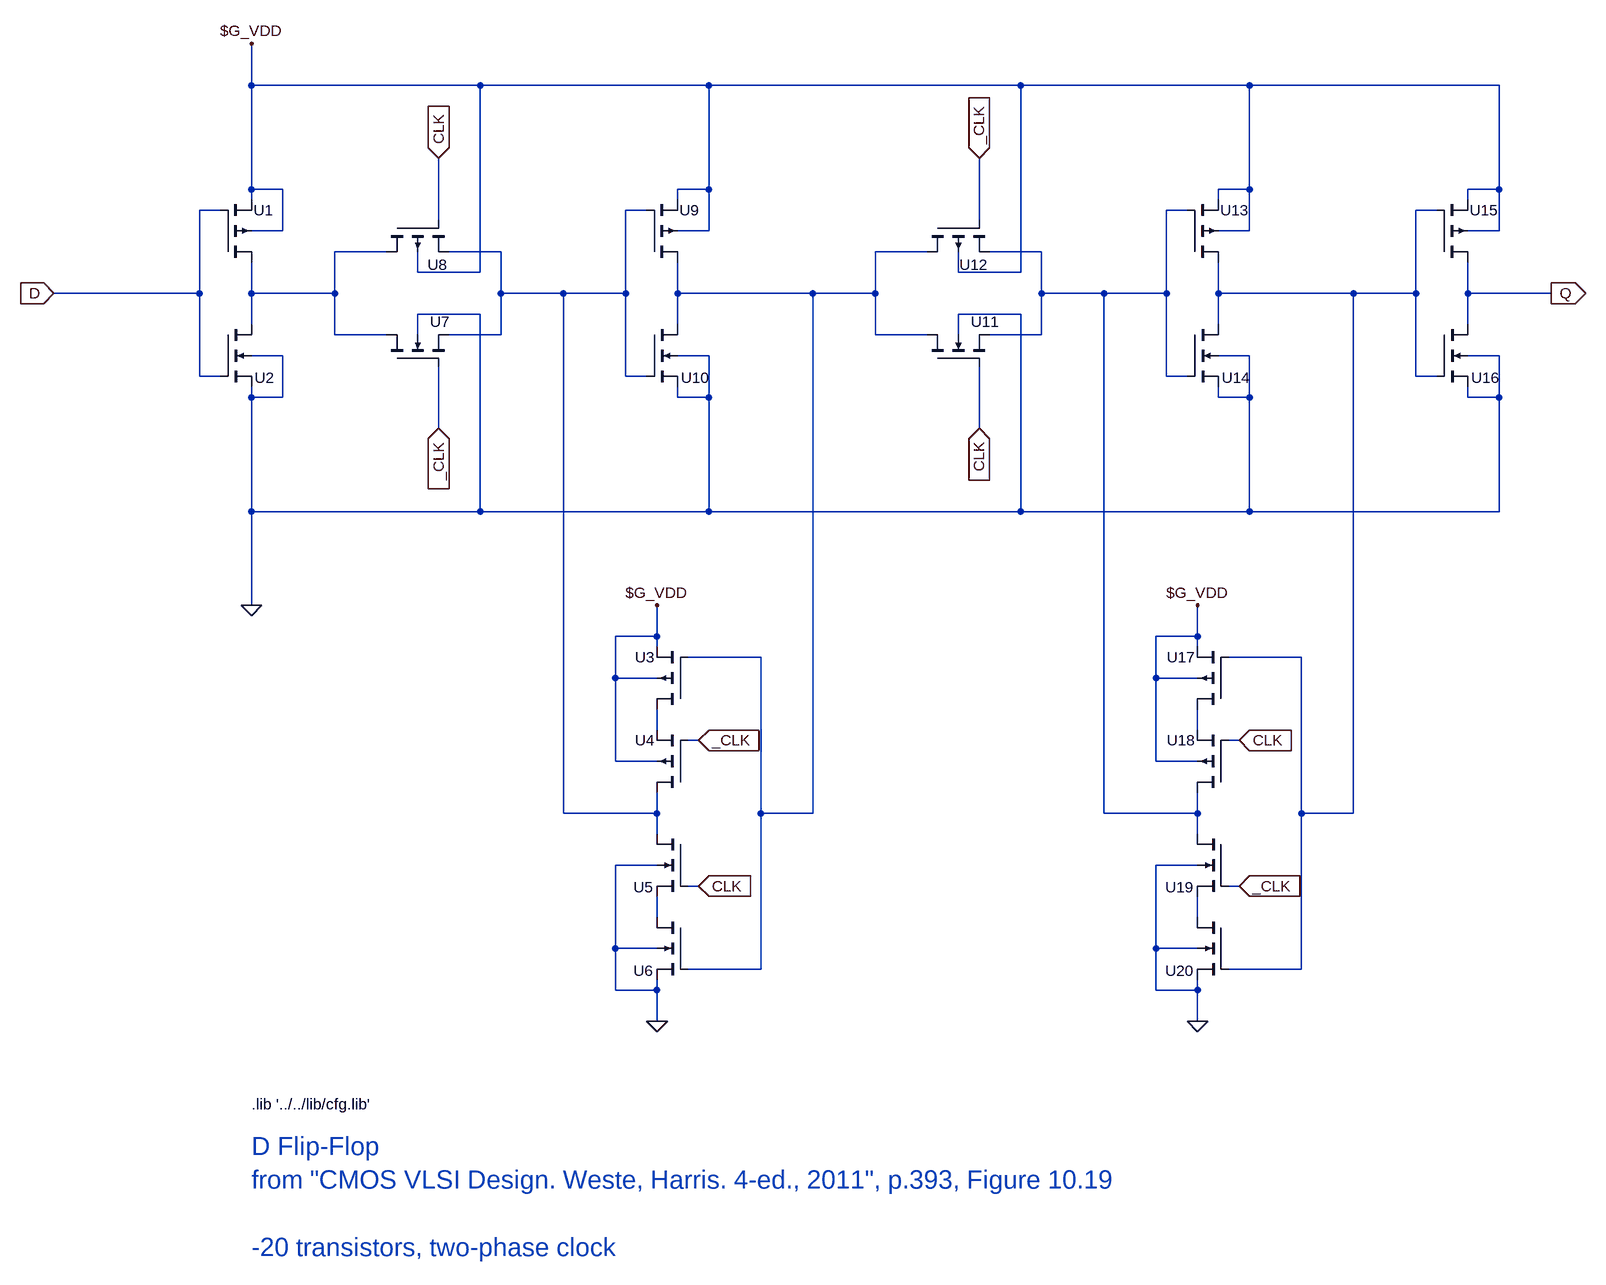
[diagram p0: schematic ff1.asc]
ff1.asc, the LTspice schematic file:
Version 4
SHEET 1 2652 3572
WIRE -5760 1088 -5760 1024
WIRE -5408 1088 -5760 1088
WIRE -5056 1088 -5408 1088
WIRE -4576 1088 -5056 1088
WIRE -4224 1088 -4576 1088
WIRE -3840 1088 -4224 1088
WIRE -5760 1248 -5760 1088
WIRE -5712 1248 -5760 1248
WIRE -5056 1248 -5056 1088
WIRE -5056 1248 -5104 1248
WIRE -4224 1248 -4224 1088
WIRE -4224 1248 -4272 1248
WIRE -3840 1248 -3840 1088
WIRE -3840 1248 -3888 1248
WIRE -5760 1264 -5760 1248
WIRE -5104 1264 -5104 1248
WIRE -4272 1264 -4272 1248
WIRE -3888 1264 -3888 1248
WIRE -5808 1280 -5840 1280
WIRE -5152 1280 -5184 1280
WIRE -4320 1280 -4352 1280
WIRE -3936 1280 -3968 1280
WIRE -5472 1296 -5472 1200
WIRE -4640 1296 -4640 1200
WIRE -5712 1312 -5712 1248
WIRE -5712 1312 -5760 1312
WIRE -5056 1312 -5056 1248
WIRE -5056 1312 -5104 1312
WIRE -4224 1312 -4224 1248
WIRE -4224 1312 -4272 1312
WIRE -3840 1312 -3840 1248
WIRE -3840 1312 -3888 1312
WIRE -5552 1344 -5632 1344
WIRE -5376 1344 -5456 1344
WIRE -4720 1344 -4800 1344
WIRE -4544 1344 -4624 1344
WIRE -5504 1376 -5504 1344
WIRE -5408 1376 -5408 1088
WIRE -5408 1376 -5504 1376
WIRE -4672 1376 -4672 1344
WIRE -4576 1376 -4576 1088
WIRE -4576 1376 -4672 1376
WIRE -5840 1408 -5840 1280
WIRE -5840 1408 -6064 1408
WIRE -5760 1408 -5760 1360
WIRE -5632 1408 -5632 1344
WIRE -5632 1408 -5760 1408
WIRE -5376 1408 -5376 1344
WIRE -5280 1408 -5376 1408
WIRE -5184 1408 -5184 1280
WIRE -5184 1408 -5280 1408
WIRE -5104 1408 -5104 1360
WIRE -4896 1408 -5104 1408
WIRE -4800 1408 -4800 1344
WIRE -4800 1408 -4896 1408
WIRE -4544 1408 -4544 1344
WIRE -4448 1408 -4544 1408
WIRE -4352 1408 -4352 1280
WIRE -4352 1408 -4448 1408
WIRE -4272 1408 -4272 1360
WIRE -4064 1408 -4272 1408
WIRE -3968 1408 -3968 1280
WIRE -3968 1408 -4064 1408
WIRE -3888 1408 -3888 1360
WIRE -3760 1408 -3888 1408
WIRE -5408 1440 -5504 1440
WIRE -4576 1440 -4672 1440
WIRE -5760 1456 -5760 1408
WIRE -5104 1456 -5104 1408
WIRE -4272 1456 -4272 1408
WIRE -3888 1456 -3888 1408
WIRE -5632 1472 -5632 1408
WIRE -5552 1472 -5632 1472
WIRE -5504 1472 -5504 1440
WIRE -5376 1472 -5376 1408
WIRE -5376 1472 -5456 1472
WIRE -4800 1472 -4800 1408
WIRE -4720 1472 -4800 1472
WIRE -4672 1472 -4672 1440
WIRE -4544 1472 -4544 1408
WIRE -4544 1472 -4624 1472
WIRE -5712 1504 -5760 1504
WIRE -5056 1504 -5104 1504
WIRE -4224 1504 -4272 1504
WIRE -3840 1504 -3888 1504
WIRE -5840 1536 -5840 1408
WIRE -5808 1536 -5840 1536
WIRE -5184 1536 -5184 1408
WIRE -5152 1536 -5184 1536
WIRE -4352 1536 -4352 1408
WIRE -4320 1536 -4352 1536
WIRE -3968 1536 -3968 1408
WIRE -3936 1536 -3968 1536
WIRE -5760 1568 -5760 1552
WIRE -5712 1568 -5712 1504
WIRE -5712 1568 -5760 1568
WIRE -5104 1568 -5104 1552
WIRE -5056 1568 -5056 1504
WIRE -5056 1568 -5104 1568
WIRE -4272 1568 -4272 1552
WIRE -4224 1568 -4224 1504
WIRE -4224 1568 -4272 1568
WIRE -3888 1568 -3888 1552
WIRE -3840 1568 -3840 1504
WIRE -3840 1568 -3888 1568
WIRE -5472 1616 -5472 1520
WIRE -4640 1616 -4640 1520
WIRE -5760 1744 -5760 1568
WIRE -5408 1744 -5408 1440
WIRE -5408 1744 -5760 1744
WIRE -5056 1744 -5056 1568
WIRE -5056 1744 -5408 1744
WIRE -4576 1744 -4576 1440
WIRE -4576 1744 -5056 1744
WIRE -4224 1744 -4224 1568
WIRE -4224 1744 -4576 1744
WIRE -3840 1744 -3840 1568
WIRE -3840 1744 -4224 1744
WIRE -5760 1888 -5760 1744
WIRE -5136 1936 -5136 1888
WIRE -5136 1936 -5200 1936
WIRE -4304 1936 -4304 1888
WIRE -4304 1936 -4368 1936
WIRE -5136 1952 -5136 1936
WIRE -4304 1952 -4304 1936
WIRE -4976 1968 -5088 1968
WIRE -4144 1968 -4256 1968
WIRE -5200 2000 -5200 1936
WIRE -5136 2000 -5200 2000
WIRE -4368 2000 -4368 1936
WIRE -4304 2000 -4368 2000
WIRE -5136 2080 -5136 2048
WIRE -4304 2080 -4304 2048
WIRE -5072 2096 -5088 2096
WIRE -4240 2096 -4256 2096
WIRE -5200 2128 -5200 2000
WIRE -5136 2128 -5200 2128
WIRE -4368 2128 -4368 2000
WIRE -4304 2128 -4368 2128
WIRE -5280 2208 -5280 1408
WIRE -5136 2208 -5136 2176
WIRE -5136 2208 -5280 2208
WIRE -4976 2208 -4976 1968
WIRE -4896 2208 -4896 1408
WIRE -4896 2208 -4976 2208
WIRE -4448 2208 -4448 1408
WIRE -4304 2208 -4304 2176
WIRE -4304 2208 -4448 2208
WIRE -4144 2208 -4144 1968
WIRE -4064 2208 -4064 1408
WIRE -4064 2208 -4144 2208
WIRE -5136 2240 -5136 2208
WIRE -4304 2240 -4304 2208
WIRE -5136 2288 -5200 2288
WIRE -4304 2288 -4368 2288
WIRE -5072 2320 -5088 2320
WIRE -4240 2320 -4256 2320
WIRE -5136 2368 -5136 2336
WIRE -4304 2368 -4304 2336
WIRE -5200 2416 -5200 2288
WIRE -5136 2416 -5200 2416
WIRE -4368 2416 -4368 2288
WIRE -4304 2416 -4368 2416
WIRE -4976 2448 -4976 2208
WIRE -4976 2448 -5088 2448
WIRE -4144 2448 -4144 2208
WIRE -4144 2448 -4256 2448
WIRE -5200 2480 -5200 2416
WIRE -5136 2480 -5136 2464
WIRE -5136 2480 -5200 2480
WIRE -4368 2480 -4368 2416
WIRE -4304 2480 -4304 2464
WIRE -4304 2480 -4368 2480
WIRE -5136 2528 -5136 2480
WIRE -4304 2528 -4304 2480
FLAG -5760 1888 0
FLAG -6064 1408 D
IOPIN -6064 1408 In
FLAG -5136 1888 $G_VDD
FLAG -5136 2528 0
FLAG -5472 1200 CLK
IOPIN -5472 1200 In
FLAG -5472 1616 _CLK
IOPIN -5472 1616 In
FLAG -4640 1200 _CLK
IOPIN -4640 1200 In
FLAG -4640 1616 CLK
IOPIN -4640 1616 In
FLAG -3760 1408 Q
IOPIN -3760 1408 Out
FLAG -5072 2320 CLK
IOPIN -5072 2320 In
FLAG -5072 2096 _CLK
IOPIN -5072 2096 In
FLAG -4304 1888 $G_VDD
FLAG -4304 2528 0
FLAG -4240 2320 _CLK
IOPIN -4240 2320 In
FLAG -4240 2096 CLK
IOPIN -4240 2096 In
FLAG -5760 1024 $G_VDD
SYMBOL pmos4 -5808 1360 M180
WINDOW 0 51 80 Left 2
WINDOW 3 52 23 Invisible 2
SYMATTR InstName U1
SYMATTR Value pmos_t1
SYMATTR Prefix X
SYMBOL nmos4 -5808 1456 R0
WINDOW 0 53 82 Left 2
WINDOW 3 53 23 Invisible 2
SYMATTR InstName U2
SYMATTR Value nmos_t1
SYMATTR Prefix X
SYMBOL pmos4 -5088 2048 R180
WINDOW 0 51 80 Left 2
WINDOW 3 52 23 Invisible 2
SYMATTR InstName U3
SYMATTR Value pmos_t1
SYMATTR Prefix X
SYMBOL pmos4 -5088 2176 R180
WINDOW 0 51 80 Left 2
WINDOW 3 52 23 Invisible 2
SYMATTR InstName U4
SYMATTR Value pmos_t1
SYMATTR Prefix X
SYMBOL nmos4 -5088 2240 M0
WINDOW 0 53 82 Left 2
WINDOW 3 53 23 Invisible 2
SYMATTR InstName U5
SYMATTR Value nmos_t1
SYMATTR Prefix X
SYMBOL nmos4 -5088 2368 M0
WINDOW 0 53 82 Left 2
WINDOW 3 53 23 Invisible 2
SYMATTR InstName U6
SYMATTR Value nmos_t1
SYMATTR Prefix X
SYMBOL nmos4 -5552 1520 R270
WINDOW 0 68 67 VRight 2
WINDOW 3 53 23 Invisible 2
SYMATTR InstName U7
SYMATTR Value nmos_t1
SYMATTR Prefix X
SYMBOL pmos4 -5552 1296 M90
WINDOW 0 68 94 VLeft 2
WINDOW 3 52 23 Invisible 2
SYMATTR InstName U8
SYMATTR Value pmos_t1
SYMATTR Prefix X
SYMBOL pmos4 -5152 1360 M180
WINDOW 0 51 80 Left 2
WINDOW 3 52 23 Invisible 2
SYMATTR InstName U9
SYMATTR Value pmos_t1
SYMATTR Prefix X
SYMBOL nmos4 -5152 1456 R0
WINDOW 0 53 82 Left 2
WINDOW 3 53 23 Invisible 2
SYMATTR InstName U10
SYMATTR Value nmos_t1
SYMATTR Prefix X
SYMBOL nmos4 -4720 1520 R270
WINDOW 0 68 67 VRight 2
WINDOW 3 53 23 Invisible 2
SYMATTR InstName U11
SYMATTR Value nmos_t1
SYMATTR Prefix X
SYMBOL pmos4 -4720 1296 M90
WINDOW 0 68 94 VLeft 2
WINDOW 3 52 23 Invisible 2
SYMATTR InstName U12
SYMATTR Value pmos_t1
SYMATTR Prefix X
SYMBOL pmos4 -4320 1360 M180
WINDOW 0 51 80 Left 2
WINDOW 3 52 23 Invisible 2
SYMATTR InstName U13
SYMATTR Value pmos_t1
SYMATTR Prefix X
SYMBOL nmos4 -4320 1456 R0
WINDOW 0 53 82 Left 2
WINDOW 3 53 23 Invisible 2
SYMATTR InstName U14
SYMATTR Value nmos_t1
SYMATTR Prefix X
SYMBOL pmos4 -3936 1360 M180
WINDOW 0 51 80 Left 2
WINDOW 3 52 23 Invisible 2
SYMATTR InstName U15
SYMATTR Value pmos_t1
SYMATTR Prefix X
SYMBOL nmos4 -3936 1456 R0
WINDOW 0 53 82 Left 2
WINDOW 3 53 23 Invisible 2
SYMATTR InstName U16
SYMATTR Value nmos_t1
SYMATTR Prefix X
SYMBOL pmos4 -4256 2048 R180
WINDOW 0 51 80 Left 2
WINDOW 3 52 23 Invisible 2
SYMATTR InstName U17
SYMATTR Value pmos_t1
SYMATTR Prefix X
SYMBOL pmos4 -4256 2176 R180
WINDOW 0 51 80 Left 2
WINDOW 3 52 23 Invisible 2
SYMATTR InstName U18
SYMATTR Value pmos_t1
SYMATTR Prefix X
SYMBOL nmos4 -4256 2240 M0
WINDOW 0 53 82 Left 2
WINDOW 3 53 23 Invisible 2
SYMATTR InstName U19
SYMATTR Value nmos_t1
SYMATTR Prefix X
SYMBOL nmos4 -4256 2368 M0
WINDOW 0 53 82 Left 2
WINDOW 3 53 23 Invisible 2
SYMATTR InstName U20
SYMATTR Value nmos_t1
SYMATTR Prefix X
TEXT -5760 2656 Left 2 !.lib '../../lib/cfg.lib'
TEXT -5760 2720 Left 4 ;D Flip-Flop\nfrom "CMOS VLSI Design. Weste, Harris. 4-ed., 2011", p.393, Figure 10.19\n \n-20 transistors, two-phase clock

The netlist it stands for:
* ff1.asc
XU1 N004 D $G_VDD $G_VDD pmos_t1  ; pins D G S B
XU2 N004 D 0 0 nmos_t1  ; pins D G S B
XU3 N006 N005 $G_VDD $G_VDD pmos_t1  ; pins D G S B
XU4 N001 _CLK N006 $G_VDD pmos_t1  ; pins D G S B
XU5 N001 CLK N008 0 nmos_t1  ; pins D G S B
XU6 N008 N005 0 0 nmos_t1  ; pins D G S B
XU7 N004 _CLK N001 0 nmos_t1  ; pins D G S B
XU8 N004 CLK N001 $G_VDD pmos_t1  ; pins D G S B
XU9 N005 N001 $G_VDD $G_VDD pmos_t1  ; pins D G S B
XU10 N005 N001 0 0 nmos_t1  ; pins D G S B
XU11 N005 CLK N002 0 nmos_t1  ; pins D G S B
XU12 N005 _CLK N002 $G_VDD pmos_t1  ; pins D G S B
XU13 N003 N002 $G_VDD $G_VDD pmos_t1  ; pins D G S B
XU14 N003 N002 0 0 nmos_t1  ; pins D G S B
XU15 Q N003 $G_VDD $G_VDD pmos_t1  ; pins D G S B
XU16 Q N003 0 0 nmos_t1  ; pins D G S B
XU17 N007 N003 $G_VDD $G_VDD pmos_t1  ; pins D G S B
XU18 N002 CLK N007 $G_VDD pmos_t1  ; pins D G S B
XU19 N002 _CLK N009 0 nmos_t1  ; pins D G S B
XU20 N009 N003 0 0 nmos_t1  ; pins D G S B
.lib '../../lib/cfg.lib'
* D Flip-Flop
* from "CMOS VLSI Design. Weste, Harris. 4-ed., 2011", p.393, Figure 10.19
* -20 transistors, two-phase clock
.backanno
.end